# Altium schematic sheet Schematic.SchDoc
size A
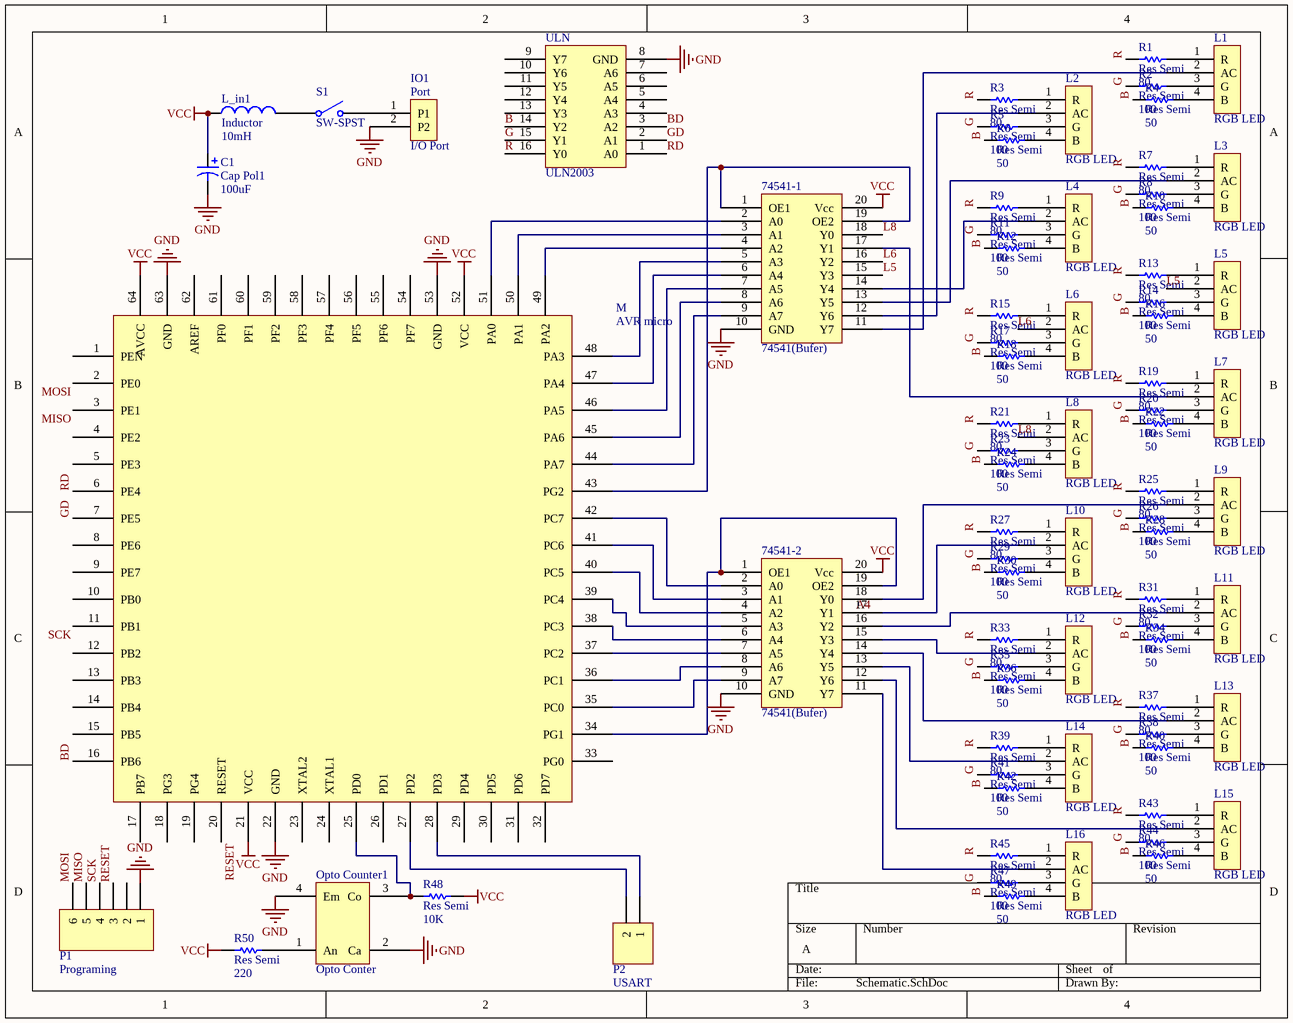
[diagram p0: Schematic.SchDoc]

## Parts
74541-1  74541(Bufer)  [SOT146-1]
74541-2  74541(Bufer)  [SOT146-1]
C1  Cap Pol1  value 100uF  [CAPPR5-5x5]
IO1  I/O Port  [I/O]
L1  RGB LED  [RGB LED]
L2  RGB LED  [RGB LED]
L3  RGB LED  [RGB LED]
L4  RGB LED  [RGB LED]
L5  RGB LED  [RGB LED]
L6  RGB LED  [RGB LED]
L7  RGB LED  [RGB LED]
L8  RGB LED  [RGB LED]
L9  RGB LED  [RGB LED]
L10  RGB LED  [RGB LED]
L11  RGB LED  [RGB LED]
L12  RGB LED  [RGB LED]
L13  RGB LED  [RGB LED]
L14  RGB LED  [RGB LED]
L15  RGB LED  [RGB LED]
L16  RGB LED  [RGB LED]
L_in1  Inductor  value 10mH  [AXIAL-0.8]
M  AVR micro  [64A_M]
Opto_Counter1  Opto Conter  [Opto Counter]
P1  Programing  [HDR1X6]
P2  USART  [HDR1X2]
R1  Res Semi  value 80  [RESC2012L]
R2  Res Semi  value 100  [RESC2012L]
R3  Res Semi  value 80  [RESC2012L]
R4  Res Semi  value 50  [RESC2012L]
R5  Res Semi  value 100  [RESC2012L]
R6  Res Semi  value 50  [RESC2012L]
R7  Res Semi  value 80  [RESC2012L]
R8  Res Semi  value 100  [RESC2012L]
R9  Res Semi  value 80  [RESC2012L]
R10  Res Semi  value 50  [RESC2012L]
R11  Res Semi  value 100  [RESC2012L]
R12  Res Semi  value 50  [RESC2012L]
R13  Res Semi  value 80  [RESC2012L]
R14  Res Semi  value 100  [RESC2012L]
R15  Res Semi  value 80  [RESC2012L]
R16  Res Semi  value 50  [RESC2012L]
R17  Res Semi  value 100  [RESC2012L]
R18  Res Semi  value 50  [RESC2012L]
R19  Res Semi  value 80  [RESC2012L]
R20  Res Semi  value 100  [RESC2012L]
R21  Res Semi  value 80  [RESC2012L]
R22  Res Semi  value 50  [RESC2012L]
R23  Res Semi  value 100  [RESC2012L]
R24  Res Semi  value 50  [RESC2012L]
R25  Res Semi  value 80  [RESC2012L]
R26  Res Semi  value 100  [RESC2012L]
R27  Res Semi  value 80  [RESC2012L]
R28  Res Semi  value 50  [RESC2012L]
R29  Res Semi  value 100  [RESC2012L]
R30  Res Semi  value 50  [RESC2012L]
R31  Res Semi  value 80  [RESC2012L]
R32  Res Semi  value 100  [RESC2012L]
R33  Res Semi  value 80  [RESC2012L]
R34  Res Semi  value 50  [RESC2012L]
R35  Res Semi  value 100  [RESC2012L]
R36  Res Semi  value 50  [RESC2012L]
R37  Res Semi  value 80  [RESC2012L]
R38  Res Semi  value 100  [RESC2012L]
R39  Res Semi  value 80  [RESC2012L]
R40  Res Semi  value 50  [RESC2012L]
R41  Res Semi  value 100  [RESC2012L]
R42  Res Semi  value 50  [RESC2012L]
R43  Res Semi  value 80  [RESC2012L]
R44  Res Semi  value 100  [RESC2012L]
R45  Res Semi  value 80  [RESC2012L]
R46  Res Semi  value 50  [RESC2012L]
R47  Res Semi  value 100  [RESC2012L]
R48  Res Semi  value 10K  [RESC2012L]
R49  Res Semi  value 50  [RESC2012L]
R50  Res Semi  value 220  [RESC2012L]
S1  SW-SPST  [SPST-2]
ULN  ULN2003  [A16]

## Nets
GND: 74541-1.10(GND) 74541-2.10(GND) C1.2 IO1.2(P2) M.22(GND) M.53(GND) M.63(GND) Opto_Counter1.2(Ca) Opto_Counter1.4(Em) P1.1 ULN.8(GND)
VCC: 74541-1.20(Vcc) 74541-2.20(Vcc) C1.1 L_in1.1 M.21(VCC) M.52(VCC) M.64(AVCC) R48.2 R50.1
B: R4.1 R6.1 R10.1 R12.1 R16.1 R18.1 R22.1 R24.1 R28.1 R30.1 R34.1 R36.1 R40.1 R42.1 R46.1 R49.1 ULN.14(Y2)
BD: M.16(PB6) ULN.3(A2)
G: R2.1 R5.1 R8.1 R11.1 R14.1 R17.1 R20.1 R23.1 R26.1 R29.1 R32.1 R35.1 R38.1 R41.1 R44.1 R47.1 ULN.15(Y1)
GD: M.7(PE5) ULN.2(A1)
L5: 74541-1.15(Y3) L5.2(AC)
L6: 74541-1.16(Y2) L6.2(AC)
L8: 74541-1.18(Y0) L8.2(AC)
MISO: M.3(PE1) P1.5
MOSI: M.2(PE0) P1.6
R: R1.1 R3.1 R7.1 R9.1 R13.1 R15.1 R19.1 R21.1 R25.1 R27.1 R31.1 R33.1 R37.1 R39.1 R43.1 R45.1 ULN.16(Y0)
RD: M.6(PE4) ULN.1(A0)
RESET: M.20(RESET) P1.3
SCK: M.11(PB1) P1.4
Net74541-1_1: 74541-1.1(OE1) 74541-1.19(OE2) M.43(PG2)
Net74541-1_2: 74541-1.2(A0) M.51(PA0)
Net74541-1_3: 74541-1.3(A1) M.50(PA1)
Net74541-1_4: 74541-1.4(A2) M.49(PA2)
Net74541-1_5: 74541-1.5(A3) M.48(PA3)
Net74541-1_6: 74541-1.6(A4) M.47(PA4)
Net74541-1_7: 74541-1.7(A5) M.46(PA5)
Net74541-1_8: 74541-1.8(A6) M.45(PA6)
Net74541-1_9: 74541-1.9(A7) M.44(PA7)
Net74541-1_11: 74541-1.11(Y7) L1.2(AC)
Net74541-1_12: 74541-1.12(Y6) L2.2(AC)
Net74541-1_13: 74541-1.13(Y5) L3.2(AC)
Net74541-1_14: 74541-1.14(Y4) L4.2(AC)
Net74541-1_17: 74541-1.17(Y1) L7.2(AC)
Net74541-2_1: 74541-2.1(OE1) 74541-2.19(OE2) M.34(PG1)
Net74541-2_2: 74541-2.2(A0) M.42(PC7)
Net74541-2_3: 74541-2.3(A1) M.41(PC6)
Net74541-2_4: 74541-2.4(A2) M.40(PC5)
Net74541-2_5: 74541-2.5(A3) M.39(PC4)
Net74541-2_6: 74541-2.6(A4) M.38(PC3)
Net74541-2_7: 74541-2.7(A5) M.37(PC2)
Net74541-2_8: 74541-2.8(A6) M.36(PC1)
Net74541-2_9: 74541-2.9(A7) M.35(PC0)
Net74541-2_11: 74541-2.11(Y7) L16.2(AC)
Net74541-2_12: 74541-2.12(Y6) L15.2(AC)
Net74541-2_13: 74541-2.13(Y5) L14.2(AC)
Net74541-2_14: 74541-2.14(Y4) L13.2(AC)
Net74541-2_15: 74541-2.15(Y3) L12.2(AC)
Net74541-2_16: 74541-2.16(Y2) L11.2(AC)
Net74541-2_17: 74541-2.17(Y1) L10.2(AC)
Net74541-2_18: 74541-2.18(Y0) L9.2(AC)
NetIO1_1: IO1.1(P1) S1.2(NO)
NetL1_1: L1.1(R) R1.2
NetL1_3: L1.3(G) R2.2
NetL1_4: L1.4(B) R4.2
NetL2_1: L2.1(R) R3.2
NetL2_3: L2.3(G) R5.2
NetL2_4: L2.4(B) R6.2
NetL3_1: L3.1(R) R7.2
NetL3_3: L3.3(G) R8.2
NetL3_4: L3.4(B) R10.2
NetL4_1: L4.1(R) R9.2
NetL4_3: L4.3(G) R11.2
NetL4_4: L4.4(B) R12.2
NetL5_1: L5.1(R) R13.2
NetL5_3: L5.3(G) R14.2
NetL5_4: L5.4(B) R16.2
NetL6_1: L6.1(R) R15.2
NetL6_3: L6.3(G) R17.2
NetL6_4: L6.4(B) R18.2
NetL7_1: L7.1(R) R19.2
NetL7_3: L7.3(G) R20.2
NetL7_4: L7.4(B) R22.2
NetL8_1: L8.1(R) R21.2
NetL8_3: L8.3(G) R23.2
NetL8_4: L8.4(B) R24.2
NetL9_1: L9.1(R) R25.2
NetL9_3: L9.3(G) R26.2
NetL9_4: L9.4(B) R28.2
NetL10_1: L10.1(R) R27.2
NetL10_3: L10.3(G) R29.2
NetL10_4: L10.4(B) R30.2
NetL11_1: L11.1(R) R31.2
NetL11_3: L11.3(G) R32.2
NetL11_4: L11.4(B) R34.2
NetL12_1: L12.1(R) R33.2
NetL12_3: L12.3(G) R35.2
NetL12_4: L12.4(B) R36.2
NetL13_1: L13.1(R) R37.2
NetL13_3: L13.3(G) R38.2
NetL13_4: L13.4(B) R40.2
NetL14_1: L14.1(R) R39.2
NetL14_3: L14.3(G) R41.2
NetL14_4: L14.4(B) R42.2
NetL15_1: L15.1(R) R43.2
NetL15_3: L15.3(G) R44.2
NetL15_4: L15.4(B) R46.2
NetL16_1: L16.1(R) R45.2
NetL16_3: L16.3(G) R47.2
NetL16_4: L16.4(B) R49.2
NetL_in1_2: L_in1.2 S1.1(COMMON)
NetM_25: M.25(PD0) Opto_Counter1.3(Co) R48.1
NetM_27: M.27(PD2) P2.2
NetM_28: M.28(PD3) P2.1
NetOpto_Counter1_1: Opto_Counter1.1(An) R50.2

Not connected (* = marked no-connect by the designer): M 1(PEN) 4(PE2) 5(PE3) 8(PE6) 9(PE7) 10(PB0) 12(PB2) 13(PB3) 14(PB4) 15(PB5) 17(PB7) 18(PG3) 19(PG4) 23(XTAL2) 24(XTAL1) 26(PD1) 29(PD4) 30(PD5) 31(PD6) 32(PD7) 33(PG0) 54(PF7) 55(PF6) 56(PF5) 57(PF4) 58(PF3) 59(PF2) 60(PF1) 61(PF0) 62(AREF); P1 2; ULN 4(A3) 5(A4) 6(A5) 7(A6) 9(Y7) 10(Y6) 11(Y5) 12(Y4) 13(Y3)

## Notes on the sheet
- Labels drawn without touching a wire or pin: A4
- (in symbol I/O Port) Port

## Library data of the parts
C1 = Cap Pol1: Polarized Capacitor (Radial); Published: 8-Jun-2000; LatestRevisionDate: 17-Jul-2002; LatestRevisionNote: Re-released for DXP Platform.; PackageReference: RB7.6-15; Publisher: Altium Limited
L_in1 = Inductor: Code_IEC: 1005; Published: 8-Jun-2000; LatestRevisionDate: 29-May-2009; LatestRevisionNote: IPC-7351 Footprint Added.; PackageReference: 0402-A; Publisher: Altium Limited; PackageDescription: Chip Inductor; Code_JEITA: 0402
M = ATmega64
Opto_Counter1 = Opto Counter
P1 = Header 6: Header, 6-Pin; LatestRevisionDate: 17-Jul-2002; LatestRevisionNote: Re-released for DXP Platform.; Publisher: Altium Limited
P2 = Header 2: Header, 2-Pin; LatestRevisionDate: 17-Jul-2002; LatestRevisionNote: Re-released for DXP Platform.; Publisher: Altium Limited
R1-R50 = Res Semi: Semiconductor Resistor; Published: 8-Jun-2000; LatestRevisionDate: 17-Jul-2002; LatestRevisionNote: Re-released for DXP Platform.; PackageReference: AXIAL-0.5; Publisher: Altium Limited
S1 = SW-SPST: Single-Pole, Single-Throw Switch; Published: 24-Mar-1999; LatestRevisionDate: 17-Jul-2002; LatestRevisionNote: Re-released for DXP Platform.; PackageReference: SPST-2; Publisher: Altium Limited